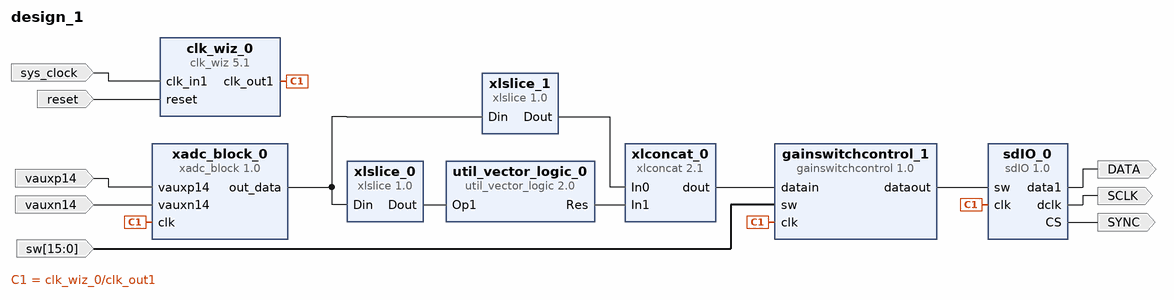
[diagram p0: block diagram of the top level]
# Vivado block design design_1, Vivado 2015.1
create_bd_design design_1

create_bd_port -dir I -type clk sys_clock
set_property -dict {CONFIG.FREQ_HZ 100000000 CONFIG.PHASE 0.000} [get_bd_ports sys_clock]
create_bd_port -dir I -type rst reset
set_property -dict {CONFIG.POLARITY ACTIVE_HIGH} [get_bd_ports reset]
create_bd_port -dir I vauxp14
create_bd_port -dir I vauxn14
create_bd_port -dir O SCLK
create_bd_port -dir O DATA
create_bd_port -dir O SYNC
create_bd_port -dir I -from 15 -to 0 sw

create_bd_cell -type ip -vlnv xilinx.com:ip:clk_wiz:5.1 clk_wiz_0
set_property -dict [list \
  CONFIG.USE_BOARD_FLOW true \
  CONFIG.CLK_IN1_BOARD_INTERFACE sys_clock \
  CONFIG.RESET_BOARD_INTERFACE reset \
] [get_bd_cells clk_wiz_0]
create_bd_cell -type ip -vlnv user.org:user:xadc_block:1.0 xadc_block_0
create_bd_cell -type ip -vlnv xilinx.com:ip:xlslice:1.0 xlslice_0
set_property -dict {CONFIG.DOUT_WIDTH 1 CONFIG.DIN_TO 15 CONFIG.DIN_FROM 15 CONFIG.DIN_WIDTH 16} [get_bd_cells xlslice_0]
create_bd_cell -type ip -vlnv xilinx.com:ip:xlslice:1.0 xlslice_1
set_property -dict {CONFIG.DOUT_WIDTH 15 CONFIG.DIN_TO 0 CONFIG.DIN_FROM 14 CONFIG.DIN_WIDTH 16} [get_bd_cells xlslice_1]
create_bd_cell -type ip -vlnv xilinx.com:ip:xlconcat:2.1 xlconcat_0
create_bd_cell -type ip -vlnv xilinx.com:ip:util_vector_logic:2.0 util_vector_logic_0
set_property -dict {CONFIG.C_OPERATION not} [get_bd_cells util_vector_logic_0]
create_bd_cell -type ip -vlnv user.org:user:sdIO:1.0 sdIO_0
create_bd_cell -type ip -vlnv user.org:user:gainswitchcontrol:1.0 gainswitchcontrol_1

# ---- connections ----

connect_bd_net -net clk_1 [get_bd_pins clk_wiz_0/clk_out1] \
  [get_bd_pins xadc_block_0/clk] [get_bd_pins sdIO_0/clk] [get_bd_pins gainswitchcontrol_1/clk]
connect_bd_net [get_bd_ports sys_clock] [get_bd_pins clk_wiz_0/clk_in1]
connect_bd_net [get_bd_ports reset] [get_bd_pins clk_wiz_0/reset]
connect_bd_net -net vauxp14_1 [get_bd_ports vauxp14] [get_bd_pins xadc_block_0/vauxp14]
connect_bd_net -net vauxn14_1 [get_bd_ports vauxn14] [get_bd_pins xadc_block_0/vauxn14]
connect_bd_net [get_bd_pins xlslice_0/Dout] [get_bd_pins util_vector_logic_0/Op1]
connect_bd_net [get_bd_pins util_vector_logic_0/Res] [get_bd_pins xlconcat_0/In1]
connect_bd_net [get_bd_pins xlslice_1/Dout] [get_bd_pins xlconcat_0/In0]
connect_bd_net [get_bd_pins xadc_block_0/out_data] [get_bd_pins xlslice_0/Din] [get_bd_pins xlslice_1/Din]
connect_bd_net [get_bd_pins xlconcat_0/dout] [get_bd_pins gainswitchcontrol_1/datain]
connect_bd_net [get_bd_ports sw] [get_bd_pins gainswitchcontrol_1/sw]
connect_bd_net [get_bd_pins sdIO_0/CS] [get_bd_ports SYNC]
connect_bd_net [get_bd_pins sdIO_0/dclk] [get_bd_ports SCLK]
connect_bd_net [get_bd_pins sdIO_0/data1] [get_bd_ports DATA]
connect_bd_net [get_bd_pins gainswitchcontrol_1/dataout] [get_bd_pins sdIO_0/sw]

validate_bd_design
save_bd_design
